# Altium project VOLTAGE_MEASURE_AC_RT.PrjPCB
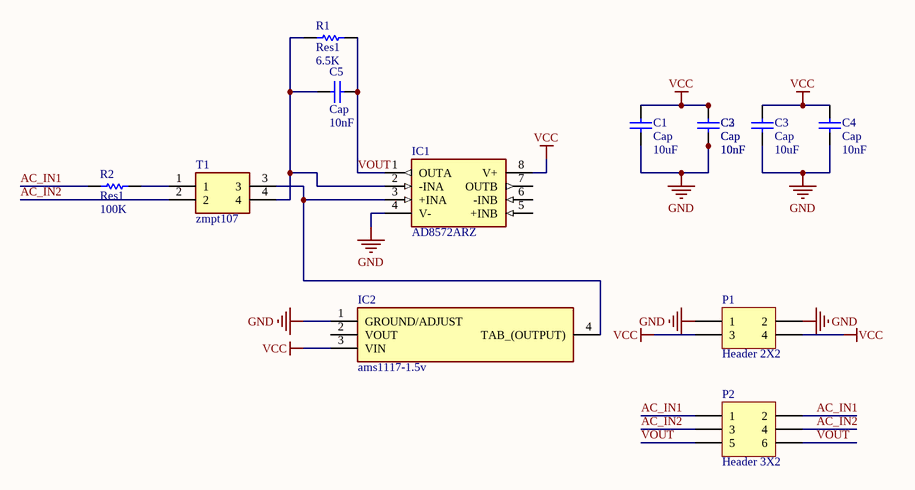
[diagram p0: VOLTAGE_MEASURE_AC_RT.SchDoc]
1 sheet, 13 parts. Net scope: global (net labels, ports and power ports of the same name join across sheets).
Board file: VOLTAGE_MEASURE_AC_RT.PcbDoc

## Sheet VOLTAGE_MEASURE_AC_RT.SchDoc
size A4

### Parts
(Parts that share a designator on the sheet are numbered #1, #2 ... from top to bottom, then left to right.)
C1  Cap  value 10uF  [1608[0603]]
C2  Cap  value 10nF  [1608[0603]]
C3#1  Cap  value 10nF  [1608[0603]]
C3#2  Cap  value 10uF  [1608[0603]]
C4  Cap  value 10nF  [1608[0603]]
C5  Cap  value 10nF  [1608[0603]]
IC1  AD8572ARZ  [SOIC127P600X175-8N]
IC2  ams1117-1.5v  [SOT229P700X180-4N]
P1  Header 2X2  [HDR2X2]
P2  Header 3X2  [HDR2X3]
R1  Res1  value 6.5K  [J1-0603]
R2  Res1  value 100K  [J1-0603]
T1  zmpt107  [zmpt107]

### Nets
GND: C1.2 C2.2 C3#1.2 C3#2.2 C4.2 IC1.4(V-) IC2.1(GROUND/ADJUST) P1.1 P1.2
VCC: C1.1 C2.1 C3#1.1 C3#2.1 C4.1 IC1.8(V+) IC2.3(VIN) P1.3 P1.4
AC_IN1: P2.1 P2.2 R2.1
AC_IN2: P2.3 P2.4 T1.2
VOUT: C5.2 IC1.1(OUTA) P2.5 P2.6 R1.2
NetC5_1: C5.1 IC1.2(-INA) R1.1 T1.4
NetIC1_3: IC1.3(+INA) IC2.4(TAB_(OUTPUT)) T1.3
NetR2_2: R2.2 T1.1

Not connected (* = marked no-connect by the designer): IC1 5(+INB) 6(-INB) 7(OUTB); IC2 2(VOUT)

### Library data of the parts
C1 C2 C3#1 C3#2 C4 C5 = Cap: Capacitor; Published: 8-Jun-2000; LatestRevisionDate: 17-Jul-2002; LatestRevisionNote: Re-released for DXP Platform.; PackageReference: RAD-0.3; Publisher: Altium Limited; PackageDescription: Radial Cap, Thru-Hole; 2 Leads; 0.3 in Pin Spacing
IC1 = AD8572ARZ: Integrated Circuit; Manufacturer_Name: Analog Devices; Datasheet Link: http://www.analog.com/static/imported-files/data_sheets/AD8571_8572_8574.pdf; Height: 1.75mm; Manufacturer_Part_Number: AD8572ARZ; Mouser Part Number: 584-AD8572ARZ; Mouser Price/Stock: https://www.mouser.com/Search/Refine.aspx?Keyword=584-AD8572ARZ; RS Part Number: 5387447P; RS Price/Stock: http://uk.rs-online.com/web/p/products/5387447P
IC2 = ams1117-3.3v: Integrated Circuit; Manufacturer_Name: Advanced Monolithic Systems; Datasheet Link: http://www.advanced-monolithic.com/pdf/ds1117.pdf; Height: 1.8mm; Manufacturer_Part_Number: ams1117-3.3v
P1 = Header 2X2: Header, 2-Pin, Dual row; LatestRevisionDate: 17-Jul-2002; LatestRevisionNote: Re-released for DXP Platform.; Publisher: Altium Limited
P2 = Header 3X2: Header, 3-Pin, Dual row; LatestRevisionDate: 17-Jul-2002; LatestRevisionNote: Re-released for DXP Platform.; Publisher: Altium Limited
R1 R2 = Res1: Resistor; Published: 8-Jun-2000; LatestRevisionDate: 17-Jul-2002; LatestRevisionNote: Re-released for DXP Platform.; PackageReference: AXIAL-0.3; Publisher: Altium Limited; PackageDescription: Axial Device, Thru-Hole; 2 Leads; 0.3 in Pin Spacing
T1 = zmpt107: Transformer; Manufacturer_Name: ZEMING-E; Datasheet Link: http://www.zeming-e.com/English/search.jsp; Height: 18mm; Manufacturer_Part_Number: zmpt107